# Altium schematic sheet MCU_RF.SchDoc
size Tabloid
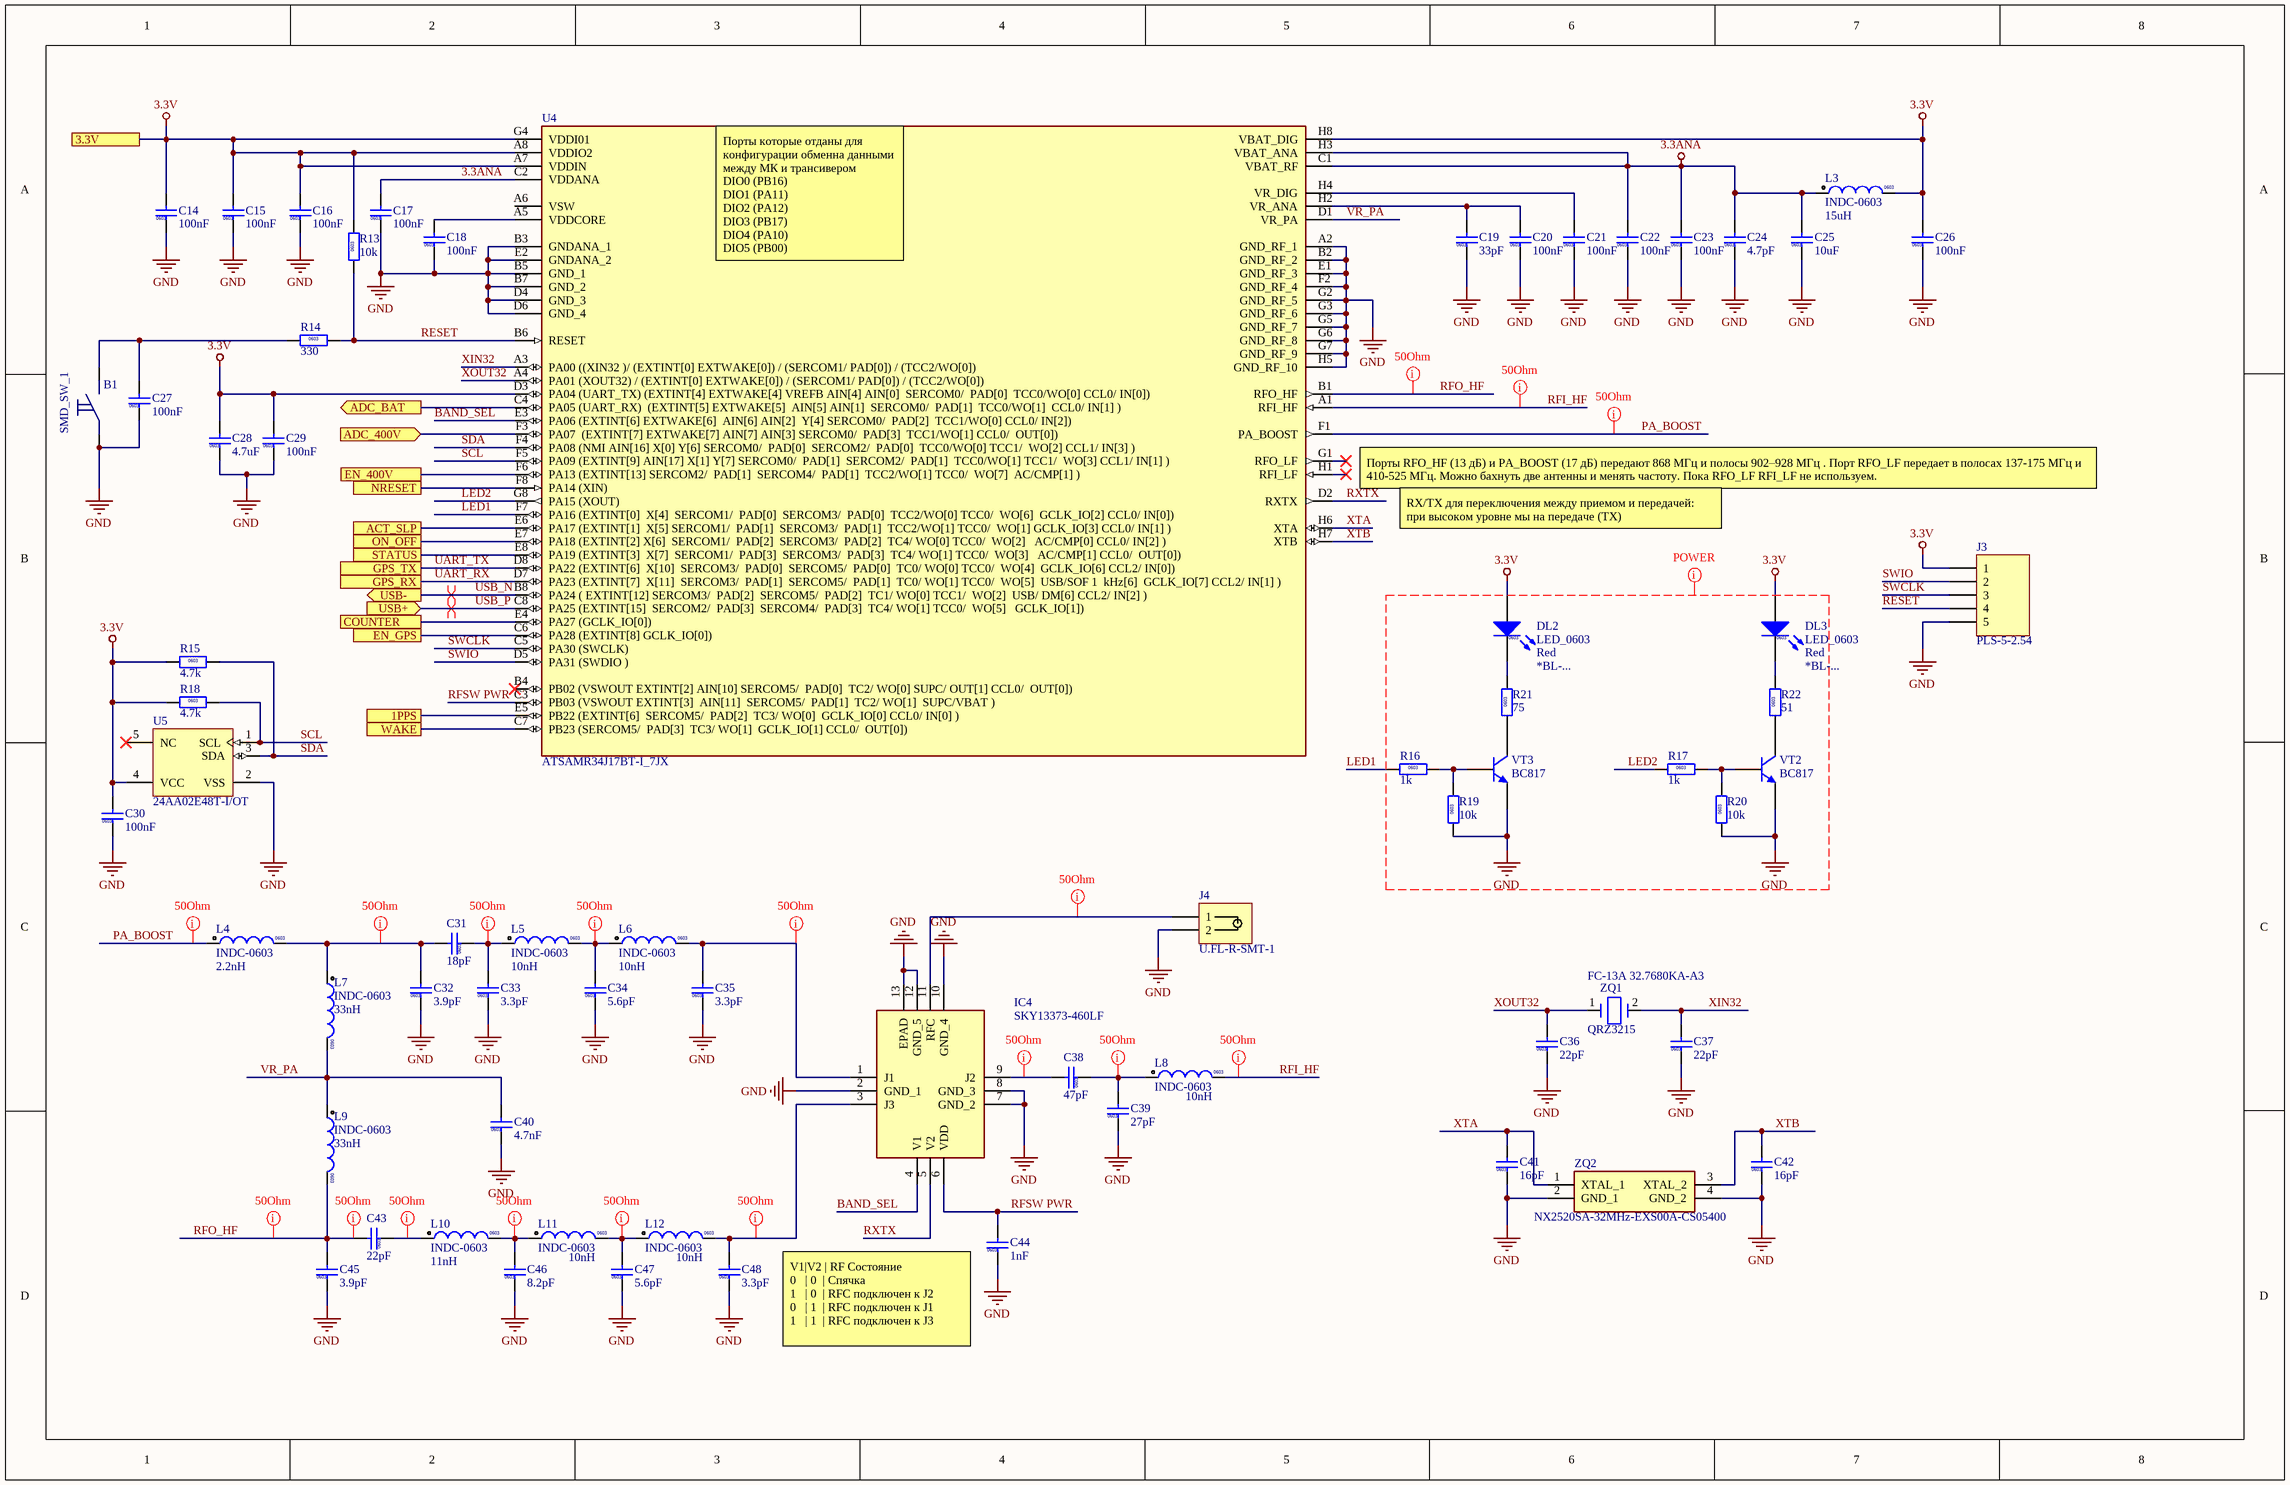
[diagram p0: MCU_RF.SchDoc]

## Parts
B1  SMD_SW_1  [SMD_SW_1]
C14  value 100nF  [CAPC1608-0603L]  (hidden comment: CAPC_0603)
C15  value 100nF  [CAPC1608-0603L]  (hidden comment: CAPC_0603)
C16  value 100nF  [CAPC1608-0603L]  (hidden comment: CAPC_0603)
C17  value 100nF  [CAPC1608-0603L]  (hidden comment: CAPC_0603)
C18  value 100nF  [CAPC1608-0603L]  (hidden comment: CAPC_0603)
C19  value 33pF  [CAPC1608-0603L]  (hidden comment: CAPC_0603)
C20  value 100nF  [CAPC1608-0603L]  (hidden comment: CAPC_0603)
C21  value 100nF  [CAPC1608-0603L]  (hidden comment: CAPC_0603)
C22  value 100nF  [CAPC1608-0603L]  (hidden comment: CAPC_0603)
C23  value 100nF  [CAPC1608-0603L]  (hidden comment: CAPC_0603)
C24  value 4.7pF  [CAPC1608-0603L]  (hidden comment: CAPC_0603)
C25  value 10uF  [CAPC1608-0603L]  (hidden comment: CAPC_0603)
C26  value 100nF  [CAPC1608-0603L]  (hidden comment: CAPC_0603)
C27  value 100nF  [CAPC1608-0603M]  (hidden comment: CAPC_0603)
C28  value 4.7uF  [CAPC1608-0603L]  (hidden comment: CAPC_0603)
C29  value 100nF  [CAPC1608-0603L]  (hidden comment: CAPC_0603)
C30  value 100nF  [CAPC1608-0603L]  (hidden comment: CAPC_0603)
C31  value 18pF  [CAPC1608-0603L]  (hidden comment: CAPC_0603)
C32  value 3.9pF  [CAPC1608-0603L]  (hidden comment: CAPC_0603)
C33  value 3.3pF  [CAPC1608-0603L]  (hidden comment: CAPC_0603)
C34  value 5.6pF  [CAPC1608-0603L]  (hidden comment: CAPC_0603)
C35  value 3.3pF  [CAPC1608-0603L]  (hidden comment: CAPC_0603)
C36  value 22pF  [CAPC1608-0603L]  (hidden comment: CAPC_0603)
C37  value 22pF  [CAPC1608-0603L]  (hidden comment: CAPC_0603)
C38  value 47pF  [CAPC1608-0603L]  (hidden comment: CAPC_0603)
C39  value 27pF  [CAPC1608-0603L]  (hidden comment: CAPC_0603)
C40  value 4.7nF  [CAPC1608-0603L]  (hidden comment: CAPC_0603)
C41  value 16pF  [CAPC1608-0603L]  (hidden comment: CAPC_0603)
C42  value 16pF  [CAPC1608-0603L]  (hidden comment: CAPC_0603)
C43  value 22pF  [CAPC1608-0603L]  (hidden comment: CAPC_0603)
C44  value 1nF  [CAPC1608-0603L]  (hidden comment: CAPC_0603)
C45  value 3.9pF  [CAPC1608-0603L]  (hidden comment: CAPC_0603)
C46  value 8.2pF  [CAPC1608-0603L]  (hidden comment: CAPC_0603)
C47  value 5.6pF  [CAPC1608-0603L]  (hidden comment: CAPC_0603)
C48  value 3.3pF  [CAPC1608-0603L]  (hidden comment: CAPC_0603)
DL2  LED_0603  Color: Red  Part number: *BL-...  [DIODEC1608-0603]
DL3  LED_0603  Color: Red  Part number: *BL-...  [DIODEC1608-0603]
IC4  SKY13373-460LF  [QFN50P200X200X60-13N-D]
J3  PLS-5-2.54  [PLS-5-2.54]
J4  U.FL-R-SMT-1  [HIROSE_U.FL-R-SMT-1(10)]
L3  INDC-0603  value 15uH  [INDC1608AL]
L4  INDC-0603  value 2.2nH  [INDC1608AL]
L5  INDC-0603  value 10nH  [INDC1608AL]
L6  INDC-0603  value 10nH  [INDC1608AL]
L7  INDC-0603  value 33nH  [INDC1608AL]
L8  INDC-0603  value 10nH  [INDC1608AL]
L9  INDC-0603  value 33nH  [INDC1608AL]
L10  INDC-0603  value 11nH  [INDC1608AL]
L11  INDC-0603  value 10nH  [INDC1608AL]
L12  INDC-0603  value 10nH  [INDC1608AL]
R13  value 10k  [RESC1608-0603M]  (hidden comment: RESC_0603_R)
R14  value 330  [RESC1608-0603M]  (hidden comment: RESC_0603_R)
R15  value 4.7k  [RESC1608-0603M]  (hidden comment: RESC_0603_R)
R16  value 1k  [RESC1608-0603M]  (hidden comment: RESC_0603_R)
R17  value 1k  [RESC1608-0603M]  (hidden comment: RESC_0603_R)
R18  value 4.7k  [RESC1608-0603M]  (hidden comment: RESC_0603_R)
R19  value 10k  [RESC1608-0603M]  (hidden comment: RESC_0603_R)
R20  value 10k  [RESC1608-0603M]  (hidden comment: RESC_0603_R)
R21  value 75  [RESC1608-0603M]  (hidden comment: RESC_0603_R)
R22  value 51  [RESC1608-0603M]  (hidden comment: RESC_0603_R)
U4  ATSAMR34J17BT-I_7JX  [BGA64C65P8X8_600X600X120]
U5  24AA02E48T-I/OT  [SOT-23-OT5_N]
VT2  BC817  [SOT23-3M]
VT3  BC817  [SOT23-3M]
ZQ1  QRZ3215  value FC-13A 32.7680KA-A3  [QRZ3215_L]
ZQ2  NX2520SA-32MHz-EXS00A-CS05400  [NX2520SA192MHzEXS00ACS05400]

## Ports
1PPS, 3.3V, ACT_SLP, ADC_400V (in), ADC_BAT (out), COUNTER, EN_400V, EN_GPS, GPS_RX, GPS_TX, NRESET, ON_OFF, STATUS, USB+ (in), USB- (out), WAKE

## Nets
3.3ANA: C17.2 C22.2 C23.2 C24.2 C25.2 L3.1 U4.C1(VBAT_RF) U4.C2(VDDANA) U4.H3(VBAT_ANA)
3.3V: C14.2 C15.2 C16.2 C26.2 C28.2 C29.2 C30.2 DL2.1(A) DL3.1(A) J3.1 L3.2 R13.2 R15.1 R18.1 U4.A7(VDDIN) U4.A8(VDDIO2) U4.D3(PA04_(UART_TX)_(EXTINT[4]_EXTWAKE[4]_VREFB_AIN[4]_AIN[0]__SERCOM0/__PAD[0]__TCC0/WO[0]_CCL0/_IN[0])) U4.G4(VDDI01) U4.H8(VBAT_DIG) U5.4(VCC) ; port 3.3V
GND: B1.1 C14.1 C15.1 C16.1 C17.1 C18.1 C19.1 C20.1 C21.1 C22.1 C23.1 C24.1 C25.1 C26.1 C27.1 C28.1 C29.1 C30.1 C32.1 C33.1 C34.1 C35.1 C36.1 C37.1 C39.1 C40.1 C41.1 C42.1 C44.1 C45.1 C46.1 C47.1 C48.1 IC4.2(GND_1) IC4.7(GND_2) IC4.8(GND_3) IC4.10(GND_4) IC4.12(GND_5) IC4.13(EPAD) J3.5 J4.2 R19.1 R20.1 U4.A2(GND_RF_1) U4.B2(GND_RF_2) U4.B3(GNDANA_1) U4.B5(GND_1) U4.B7(GND_2) U4.D4(GND_3) U4.D6(GND_4) U4.E1(GND_RF_3) U4.E2(GNDANA_2) U4.F2(GND_RF_4) U4.G2(GND_RF_5) U4.G3(GND_RF_6) U4.G5(GND_RF_7) U4.G6(GND_RF_8) U4.G7(GND_RF_9) U4.H5(GND_RF_10) U5.2(VSS) VT2.2(E) VT3.2(E) ZQ2.2(GND_1) ZQ2.4(GND_2)
1PPS: U4.E5(PB22_(EXTINT[6]__SERCOM5/__PAD[2]__TC3/_WO[0]__GCLK_IO[0]_CCL0/_IN[0]_)) ; port 1PPS
ACT_SLP: U4.E6(PA17_(EXTINT[1]__X[5]_SERCOM1/__PAD[1]__SERCOM3/__PAD[1]__TCC2/WO[1]_TCC0/__WO[1]_GCLK_IO[3]_CCL0/_IN[1]_)) ; port ACT_SLP
ADC_400V: U4.F3(PA07__(EXTINT[7]_EXTWAKE[7]_AIN[7]_AIN[3]_SERCOM0/__PAD[3]__TCC1/WO[1]_CCL0/__OUT[0])) ; port ADC_400V
ADC_BAT: U4.C4(PA05_(UART_RX)__(EXTINT[5]_EXTWAKE[5]__AIN[5]_AIN[1]__SERCOM0/__PAD[1]__TCC0/WO[1]__CCL0/_IN[1]_)) ; port ADC_BAT
BAND_SEL: IC4.4(V1) U4.E3(PA06_(EXTINT[6]_EXTWAKE[6]__AIN[6]_AIN[2]__Y[4]_SERCOM0/__PAD[2]__TCC1/WO[0]_CCL0/_IN[2]))
COUNTER: U4.E4(PA27_(GCLK_IO[0])) ; port COUNTER
EN_400V: U4.F6(PA13_(EXTINT[13]_SERCOM2/__PAD[1]__SERCOM4/__PAD[1]__TCC2/WO[1]_TCC0/__WO[7]__AC/CMP[1]_)) ; port EN_400V
EN_GPS: U4.C6(PA28_(EXTINT[8]_GCLK_IO[0])) ; port EN_GPS
LED1: R16.1 U4.F7(PA16_(EXTINT[0]__X[4]__SERCOM1/__PAD[0]__SERCOM3/__PAD[0]__TCC2/WO[0]_TCC0/__WO[6]__GCLK_IO[2]_CCL0/_IN[0]))
LED2: R17.1 U4.G8(PA15_(XOUT))
NRESET: U4.F8(PA14_(XIN)) ; port NRESET
ON_OFF: U4.E7(PA18_(EXTINT[2]_X[6]__SERCOM1/__PAD[2]__SERCOM3/__PAD[2]__TC4/_WO[0]_TCC0/__WO[2]___AC/CMP[0]_CCL0/_IN[2]_)) ; port ON_OFF
PA_BOOST: L4.1 U4.F1(PA_BOOST)
RESET: J3.4 R13.1 R14.2 U4.B6(RESET)
RFI_HF: L8.2 U4.A1(RFI_HF)
RFO_HF: C43.2 C45.2 L9.2 U4.B1(RFO_HF)
RFSW PWR: C44.2 IC4.6(VDD) U4.C3(PB03_(VSWOUT_EXTINT[3]__AIN[11]__SERCOM5/__PAD[1]__TC2/_WO[1]__SUPC/VBAT_))
RXTX: IC4.5(V2) U4.D2(RXTX)
SCL: R18.2 U4.F5(PA09_(EXTINT[9]_AIN[17]_X[1]_Y[7]_SERCOM0/__PAD[1]__SERCOM2/__PAD[1]__TCC0/WO[1]_TCC1/__WO[3]_CCL1/_IN[1]_)) U5.1(SCL)
SDA: R15.2 U4.F4(PA08_(NMI_AIN[16]_X[0]_Y[6]_SERCOM0/__PAD[0]__SERCOM2/__PAD[0]__TCC0/WO[0]_TCC1/__WO[2]_CCL1/_IN[3]_)) U5.3(SDA)
STATUS: U4.E8(PA19_(EXTINT[3]__X[7]__SERCOM1/__PAD[3]__SERCOM3/__PAD[3]__TC4/_WO[1]_TCC0/__WO[3]___AC/CMP[1]_CCL0/__OUT[0])) ; port STATUS
SWCLK: J3.3 U4.C5(PA30_(SWCLK))
SWIO: J3.2 U4.D5(PA31_(SWDIO_))
UART_RX: U4.D7(PA23_(EXTINT[7]__X[11]__SERCOM3/__PAD[1]__SERCOM5/__PAD[1]__TC0/_WO[1]_TCC0/__WO[5]__USB/SOF_1__kHz[6]__GCLK_IO[7]_CCL2/_IN[1]_)) ; port GPS_RX
UART_TX: U4.D8(PA22_(EXTINT[6]__X[10]__SERCOM3/__PAD[0]__SERCOM5/__PAD[0]__TC0/_WO[0]_TCC0/__WO[4]__GCLK_IO[6]_CCL2/_IN[0])) ; port GPS_TX
USB_N: U4.B8(PA24_(_EXTINT[12]_SERCOM3/__PAD[2]__SERCOM5/__PAD[2]__TC1/_WO[0]_TCC1/__WO[2]__USB/_DM[6]_CCL2/_IN[2]_)) ; port USB-
USB_P: U4.C8(PA25_(EXTINT[15]__SERCOM2/__PAD[3]__SERCOM4/__PAD[3]__TC4/_WO[1]_TCC0/__WO[5]___GCLK_IO[1])) ; port USB+
VR_PA: C40.2 L7.2 L9.1 U4.D1(VR_PA)
WAKE: U4.C7(PB23_(SERCOM5/__PAD[3]__TC3/_WO[1]__GCLK_IO[1]_CCL0/__OUT[0])) ; port WAKE
XIN32: C37.2 U4.A3(PA00_((XIN32_)/_(EXTINT[0]_EXTWAKE[0])_/_(SERCOM1/_PAD[0])_/_(TCC2/WO[0])) ZQ1.2
XOUT32: C36.2 U4.A4(PA01_(XOUT32)_/_(EXTINT[0]_EXTWAKE[0])_/_(SERCOM1/_PAD[0])_/_(TCC2/WO[0])) ZQ1.1
XTA: C41.2 U4.H6(XTA) ZQ2.1(XTAL_1)
XTB: C42.2 U4.H7(XTB) ZQ2.3(XTAL_2)
NetB1_2: B1.2 C27.2 R14.1
NetC18_2: C18.2 U4.A5(VDDCORE)
NetC19_2: C19.2 C20.2 U4.H2(VR_ANA)
NetC21_2: C21.2 U4.H4(VR_DIG)
NetC31_1: C31.1 C33.2 L5.1
NetC31_2: C31.2 C32.2 L4.2 L7.1
NetC34_2: C34.2 L5.2 L6.1
NetC35_2: C35.2 IC4.1(J1) L6.2
NetC38_1: C38.1 C39.2 L8.1
NetC38_2: C38.2 IC4.9(J2)
NetC43_1: C43.1 L10.1
NetC46_2: C46.2 L10.2 L11.1
NetC47_2: C47.2 L11.2 L12.1
NetC48_2: C48.2 IC4.3(J3) L12.2
NetDL2_2: DL2.2(K) R21.2
NetDL3_2: DL3.2(K) R22.2
NetIC4_11: IC4.11(RFC) J4.1
NetR16_2: R16.2 R19.2 VT3.1(B)
NetR17_2: R17.2 R20.2 VT2.1(B)
NetR21_1: R21.1 VT3.3(C)
NetR22_1: R22.1 VT2.3(C)

Not connected (* = marked no-connect by the designer): U4 A6(VSW) B4(PB02_(VSWOUT_EXTINT[2]_AIN[10]_SERCOM5/__PAD[0]__TC2/_WO[0]_SUPC/_OUT[1]_CCL0/__OUT[0]))* G1(RFO_LF)* H1(RFI_LF)*; U5 5(NC)*

## Layout directives
net class 50Ohm: NetC31_1, NetC31_2, NetC34_2, NetC35_2, NetC38_1, NetC38_2, NetC43_1, NetC46_2, NetC47_2, NetC48_2, NetIC4_11, PA_BOOST, RFI_HF, RFO_HF
net class POWER: GND, LED2
differential pair: USB_N, USB_P

## Notes on the sheet
- (near U4) Порты которые отданы для конфигурации обменна данными между МК и трансивером
  DIO0 (PB16)
  DIO1 (PA11)
  DIO2 (PA12)
  DIO3 (PB17)
  DIO4 (PA10)
  DIO5 (PB00)
- Порты RFO_HF (13 дБ) и PA_BOOST (17 дБ) передают 868 МГц и полосы 902–928 МГц . Порт RFO_LF передает в полосах 137-175 МГц и 410-525 МГц. Можно бахнуть две антенны и менять частоту. Пока RFO_LF RFI_LF не используем.
- RX/TX для переключения между приемом и передачей: при высоком уровне мы на передаче (TX)
- (near C44) V1|V2 | RF Состояние
  0   | 0  | Спячка
  1   | 0  | RFC подключен к J2
  0   | 1  | RFC подключен к J1
  1   | 1  | RFC подключен к J3
- Title
- Size:
- Date:
- Tabloid
- Number:
- Time:
- Revision:
- Sheet
- of
- File:
- (in symbol CAPC_0603) 0603
- (in symbol INDC-0603) 0603
- (in symbol LED_0603) 0603
- (in symbol RESC_0603_R) 0603

## Library data of the parts
B1 = SMD_SW_1: SMD Switch
C14-C48 = CAPC_0603: Capacitor 0603
DL2 DL3 = LED_0603: LED 0603
IC4 = SKY13373-460LF: Integrated Circuit; Manufacturer_Name: Skyworks; Datasheet Link: http://www.skyworksinc.com/uploads/documents/SKY13373_460LF_201264N.pdf; Height: 0.6mm; Manufacturer_Part_Number: SKY13373-460LF; Mouser Part Number: 873-SKY13373-460LF; Mouser Price/Stock: https://www.mouser.com/Search/Refine.aspx?Keyword=873-SKY13373-460LF
J3 = PLS-5-2.54: PLS-2-2.54; LatestRevisionDate: 17-Jul-2002; LatestRevisionNote: Re-released for DXP Platform.; Publisher: Altium Limited
J4 = U.FL-R-SMT-1: Hirose U.FL-R-SMT-1 HF connector
L3-L12 = INDC-0603: Chip Inductor, Body Body 1.6x0.8mm
R13-R22 = RESC_0603_R: Resistor 0603
U4 = ATSAMR34J17BT-I_7JX: Integrated Circuit; Manufacturer_Name: Microchip; Manufacturer_Part_Number: ATSAMR34J18BT-I/7JX; Datasheet Link: https://www.mouser.com/datasheet/2/268/SAMR34-R35-Low-Power-LoRa-Sub-GHz-SiP-Data-Sheet-D-1507280.pdf; Height: 1.2mm; Mouser Part Number: 579-SAMR34J18BTI7JX; Mouser Price/Stock: https://www.mouser.com/Search/Refine.aspx?Keyword=579-SAMR34J18BTI7JX
U5 = 24AA02E48T-I/OT: 2Kbit, 400kHz, 1.7V, I2C Serial EEPROM with EUI-48 Node Identity, 5-Pin SOT-23, Industrial Temperature, Tape and Reel; Manufacturer: Microchip; DatasheetVersion: revB, Jan-2009; PackageVersion: revBB, Aug-2009; PackageReference: SOT-23-OT5; PackageDescription: 5-Lead Plastic Small Outline Transistor (OT) [SOT-23]; Supplier 1: Digi-Key; Supplier Part Number 1: 24AA02E48T-I/OTTR-ND; Supplier 2: Digi-Key; Supplier Part Number 2: 24AA02E48T-I/OTCT-ND; Supplier 3: Digi-Key; Supplier Part Number 3: 24AA02E48T-I/OTDKR-ND; Supplier 4: Farnell; Supplier Part Number 4: 1688855; Supplier 5: Farnell; Supplier Part Number 5: 1688855RL; Supplier 6: Newark; Supplier Part Number 6: 45P4895; Supplier 7: Mouser; Supplier Part Number 7: 579-24AA02E48TIOT; Mounting Technology: Surface Mount; Code_IPC: SOT23-5; PartNumber: 24AA02E48T-I/OT; ComponentLink1Description: Manufacturer URL; ComponentLink1URL: http://www.microchip.com/; ComponentLink2Description: Datasheet; ComponentLink2URL: http://ww1.microchip.com/downloads/en/DeviceDoc/22124B.pdf; ComponentLink3Description: Package Specification; ComponentLink3URL: http://www.microchip.com/stellent/groups/techpub_sg/documents/packagingspec/en012702.pdf
VT2 VT3 = BC817: BC817 NPN Transistor
ZQ1 = QRZ3215: Quartz SMD 3.2*1.5 mm body 2 pads SMD
ZQ2 = NX2520SA-19.2MHz-EXS00A-CS05400: Crystal or Oscillator; Manufacturer_Name: NDK; Datasheet Link: https://kr.mouser.com/datasheet/2/905/ndk_08142018_NX2520SA-19.200000MHZ-NBG1-1389014.pdf; Height: 0.55mm; Manufacturer_Part_Number: NX2520SA-19.2MHz-EXS00A-CS05400; Mouser Part Number: 344-NX2520SA19.2MH54; Mouser Price/Stock: https://www.mouser.com/Search/Refine.aspx?Keyword=344-NX2520SA19.2MH54